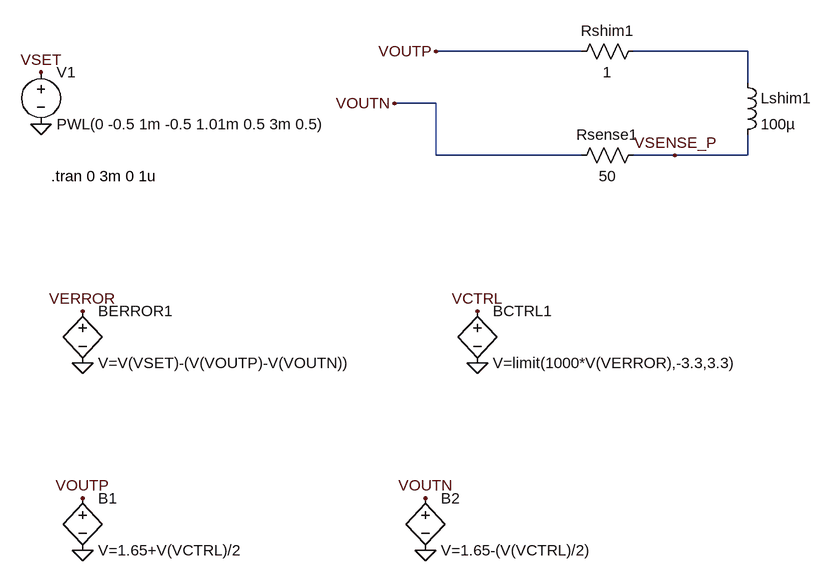
[diagram p0: schematic Draft4.asc]
Draft4.asc, the LTspice schematic file:
Version 4.1
SHEET 1 892 680
WIRE 528 -112 304 -112
WIRE 784 -112 608 -112
WIRE 784 -64 784 -112
WIRE 304 -32 240 -32
WIRE 304 48 304 -32
WIRE 528 48 304 48
WIRE 672 48 608 48
WIRE 784 48 784 16
WIRE 784 48 672 48
FLAG -304 -80 VSET
FLAG -304 0 0
FLAG 672 48 VSENSE_P
FLAG -240 288 VERROR
FLAG -240 368 0
FLAG 368 288 VCTRL
FLAG 368 368 0
FLAG -240 576 VOUTP
FLAG -240 656 0
FLAG 288 576 VOUTN
FLAG 288 656 0
FLAG 304 -112 VOUTP
FLAG 240 -32 VOUTN
SYMBOL ind 768 -80 R0
SYMATTR InstName Lshim1
SYMATTR Value 100µ
SYMBOL res 624 -128 R90
WINDOW 0 0 56 VBottom 2
WINDOW 3 32 56 VTop 2
SYMATTR InstName Rshim1
SYMATTR Value 1
SYMBOL res 624 32 R90
WINDOW 0 0 56 VBottom 2
WINDOW 3 32 56 VTop 2
SYMATTR InstName Rsense1
SYMATTR Value 50
SYMBOL bv -240 272 R0
SYMATTR InstName BERROR1
SYMATTR Value V=V(VSET)-(V(VOUTP)-V(VOUTN))
SYMBOL bv 368 272 R0
SYMATTR InstName BCTRL1
SYMATTR Value V=limit(1000*V(VERROR),-3.3,3.3)
SYMBOL voltage -304 -96 R0
SYMATTR InstName V1
SYMATTR Value PWL(0 -0.5 1m -0.5 1.01m 0.5 3m 0.5)
SYMBOL bv -240 560 R0
SYMATTR InstName B1
SYMATTR Value V=1.65+V(VCTRL)/2
SYMBOL bv 288 560 R0
SYMATTR InstName B2
SYMATTR Value V=1.65-(V(VCTRL)/2)
TEXT -288 80 Left 2 !.tran 0 3m 0 1u

The netlist it stands for:
* Draft4.asc
Lshim1 N001 VSENSE_P 100µ
Rshim1 N001 VOUTP 1
Rsense1 VSENSE_P VOUTN 50
BERROR1 VERROR 0 V=V(VSET)-(V(VOUTP)-V(VOUTN))
BCTRL1 VCTRL 0 V=limit(1000*V(VERROR),-3.3,3.3)
V1 VSET 0 PWL(0 -0.5 1m -0.5 1.01m 0.5 3m 0.5)
B1 VOUTP 0 V=1.65+V(VCTRL)/2
B2 VOUTN 0 V=1.65-(V(VCTRL)/2)
.tran 0 3m 0 1u
.backanno
.end